# Altium schematic sheet TPS63060.SchDoc
size A4
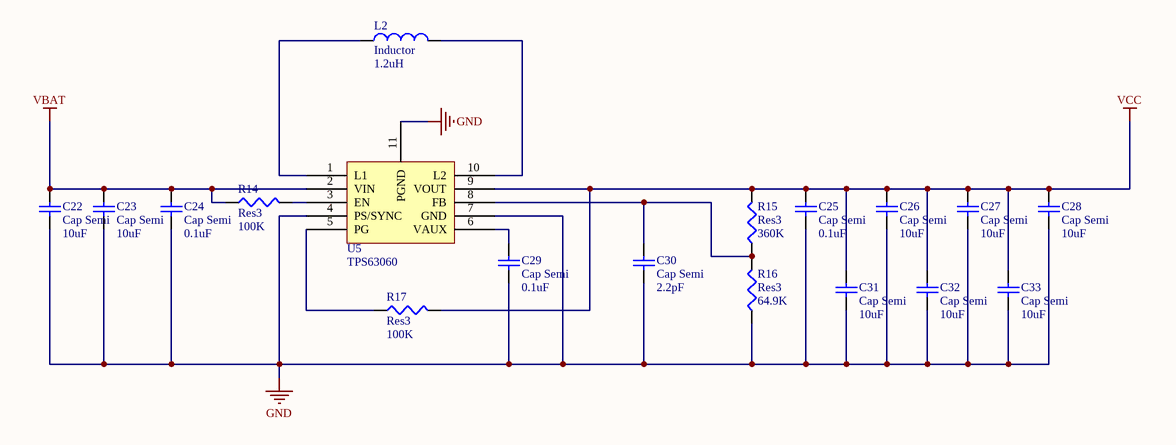
[diagram p0: TPS63060.SchDoc]

## Parts
C22  Cap Semi  value 10uF  [1608[0603]]
C23  Cap Semi  value 10uF  [1608[0603]]
C24  Cap Semi  value 0.1uF  [1608[0603]]
C25  Cap Semi  value 0.1uF  [1608[0603]]
C26  Cap Semi  value 10uF  [1608[0603]]
C27  Cap Semi  value 10uF  [1608[0603]]
C28  Cap Semi  value 10uF  [1608[0603]]
C29  Cap Semi  value 0.1uF  [1608[0603]]
C30  Cap Semi  value 2.2pF  [1608[0603]]
C31  Cap Semi  value 10uF  [1608[0603]]
C32  Cap Semi  value 10uF  [1608[0603]]
C33  Cap Semi  value 10uF  [1608[0603]]
L2  Inductor  value 1.2uH  [INDC4532]
R14  Res3  value 100K  [J1-0603]
R15  Res3  value 360K  [J1-0603]
R16  Res3  value 64.9K  [J1-0603]
R17  Res3  value 100K  [J1-0603]
U5  TPS63060  [S-PSWON-N10]

## Nets
GND: C22.1 C23.1 C24.1 C25.1 C26.1 C27.1 C28.1 C29.1 C30.1 C31.1 C32.1 C33.1 R16.1 U5.4(PS/SYNC) U5.7(GND) U5.11(PGND)
VBAT: C22.2 C23.2 C24.2 R14.1 U5.2(VIN)
VCC: C25.2 C26.2 C27.2 C28.2 C31.2 C32.2 C33.2 R15.2 R17.2 U5.9(VOUT)
NetC29_2: C29.2 U5.6(VAUX)
NetC30_2: C30.2 R15.1 R16.2 U5.8(FB)
NetL2_1: L2.1 U5.1(L1)
NetL2_2: L2.2 U5.10(L2)
NetR14_2: R14.2 U5.3(EN)
NetR17_1: R17.1 U5.5(PG)

## Library data of the parts
C22-C33 = Cap Semi: Capacitor (Semiconductor SIM Model); Published: 8-Jun-2000; LatestRevisionDate: 29-May-2009; LatestRevisionNote: IPC-7351 Footprint Added.; PackageReference: C1206; Publisher: Altium Limited; PackageDescription: Chip Capacitor
L2 = Inductor: Code_IEC: 1005; Published: 8-Jun-2000; LatestRevisionDate: 29-May-2009; LatestRevisionNote: IPC-7351 Footprint Added.; PackageReference: 0402-A; Publisher: Altium Limited; PackageDescription: Chip Inductor; Code_JEITA: 0402
R14-R17 = Res3: Resistor; Published: 8-Jun-2000; LatestRevisionDate: 29-May-2009; LatestRevisionNote: IPC-7351 Footprint Added.; PackageReference: J1-0603; Publisher: Altium Limited; PackageDescription: Chip Resistor